# Altium schematic sheet CW308T_K24_Micro.SchDoc: <Enter Sheet Title>
size Letter; Organization: NewAE Technology Inc.; Address1: 1083 Queen St., Suite 196; Address2: Halifax; Address3: NS; Address4: Canada B3H 0B2; SheetApproved: NO
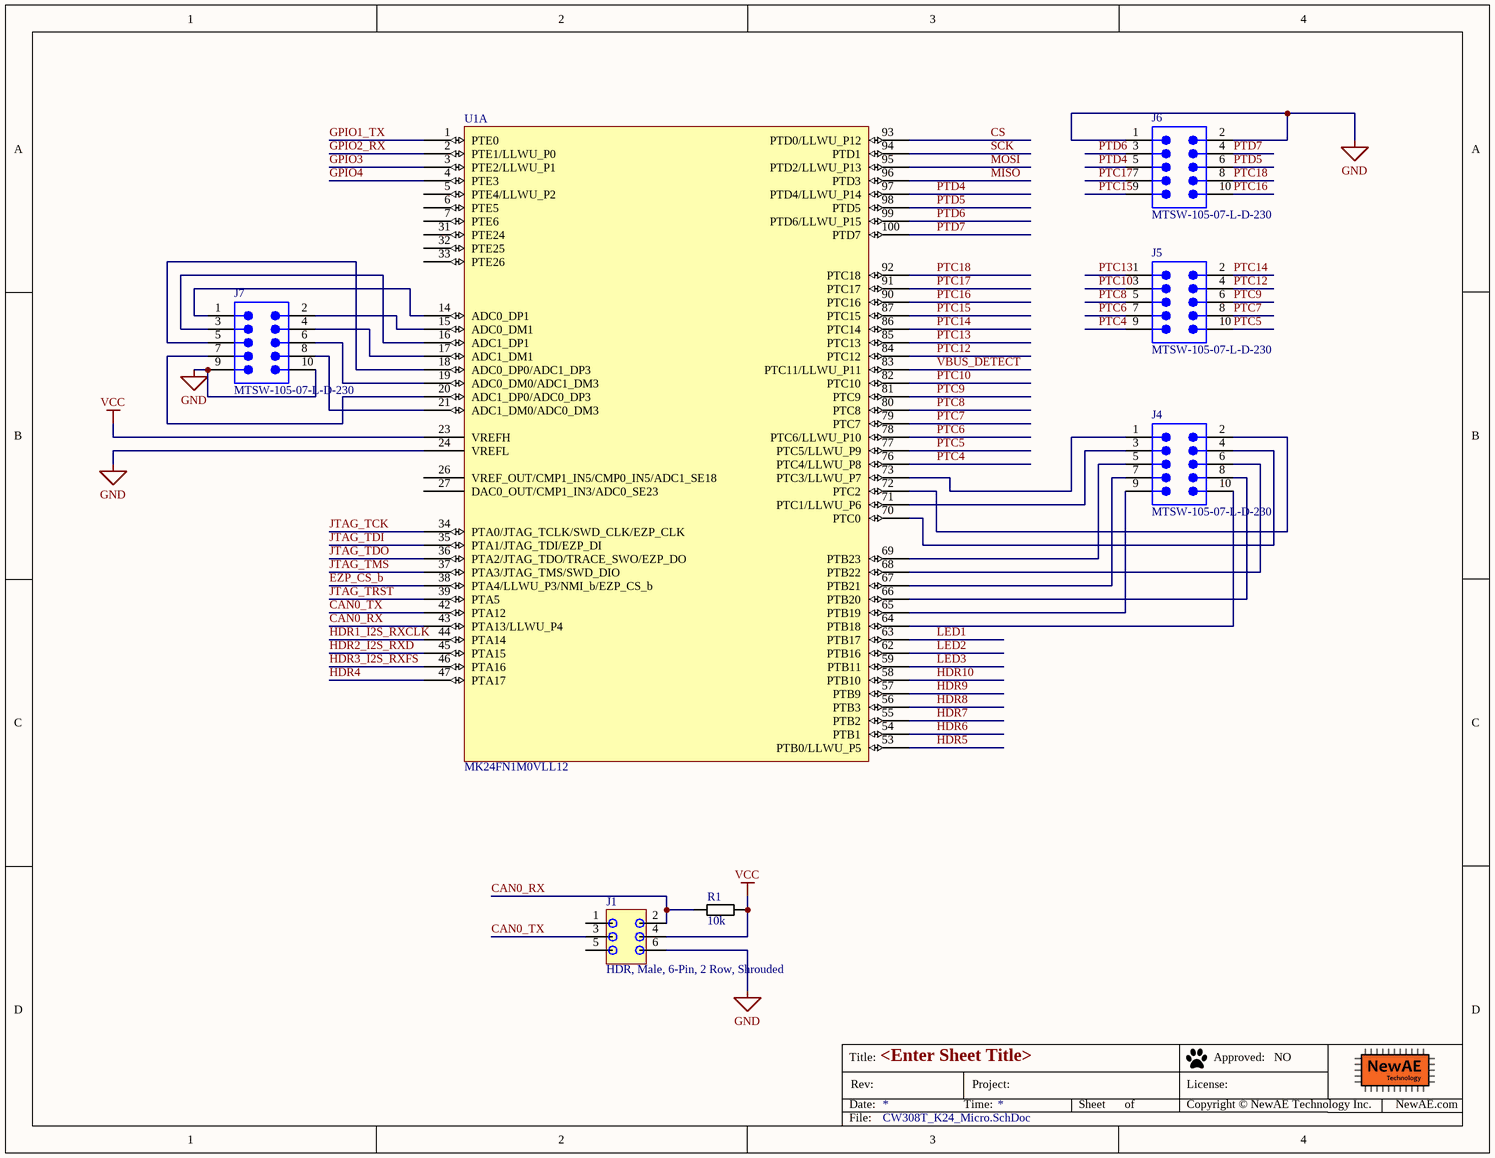
[diagram p0: CW308T_K24_Micro.SchDoc]

## Parts
J1  HDR, Male, 6-Pin, 2 Row, Shrouded  [HDR_6PIN_2ROW_SHROUD]
J4  MTSW-105-07-L-D-230  [SMTC-MTSW-105-07-X-D-230]
J5  MTSW-105-07-L-D-230  [SMTC-MTSW-105-07-X-D-230]
J6  MTSW-105-07-L-D-230  [SMTC-MTSW-105-07-X-D-230]
J7  MTSW-105-07-L-D-230  [SMTC-MTSW-105-07-X-D-230]
R1  10k  [RESC1608X55N]
U1  MK24FN1M0VLL12  [SQFP50P1600X1600X170-100N]  (part A of 2)

## Nets
GND: J1.6 J6.1 J6.2 J7.9 J7.10 U1.24(VREFL)
VCC: J1.4 R1.2 U1.23(VREFH)
CAN0_RX: J1.2 R1.1 U1.43(PTA13/LLWU_P4)
CAN0_TX: J1.3 U1.42(PTA12)
CS: U1.93(PTD0/LLWU_P12)
EZP_CS_b: U1.38(PTA4/LLWU_P3/NMI_b/EZP_CS_b)
GPIO1_TX: U1.1(PTE0)
GPIO2_RX: U1.2(PTE1/LLWU_P0)
GPIO3: U1.3(PTE2/LLWU_P1)
GPIO4: U1.4(PTE3)
HDR1_I2S_RXCLK: U1.44(PTA14)
HDR2_I2S_RXD: U1.45(PTA15)
HDR3_I2S_RXFS: U1.46(PTA16)
HDR4: U1.47(PTA17)
HDR5: U1.53(PTB0/LLWU_P5)
HDR6: U1.54(PTB1)
HDR7: U1.55(PTB2)
HDR8: U1.56(PTB3)
HDR9: U1.57(PTB9)
HDR10: U1.58(PTB10)
JTAG_TCK: U1.34(PTA0/JTAG_TCLK/SWD_CLK/EZP_CLK)
JTAG_TDI: U1.35(PTA1/JTAG_TDI/EZP_DI)
JTAG_TDO: U1.36(PTA2/JTAG_TDO/TRACE_SWO/EZP_DO)
JTAG_TMS: U1.37(PTA3/JTAG_TMS/SWD_DIO)
JTAG_TRST: U1.39(PTA5)
LED1: U1.63(PTB17)
LED2: U1.62(PTB16)
LED3: U1.59(PTB11)
MISO: U1.96(PTD3)
MOSI: U1.95(PTD2/LLWU_P13)
PTC4: J5.9 U1.76(PTC4/LLWU_P8)
PTC5: J5.10 U1.77(PTC5/LLWU_P9)
PTC6: J5.7 U1.78(PTC6/LLWU_P10)
PTC7: J5.8 U1.79(PTC7)
PTC8: J5.5 U1.80(PTC8)
PTC9: J5.6 U1.81(PTC9)
PTC10: J5.3 U1.82(PTC10)
PTC12: J5.4 U1.84(PTC12)
PTC13: J5.1 U1.85(PTC13)
PTC14: J5.2 U1.86(PTC14)
PTC15: J6.9 U1.87(PTC15)
PTC16: J6.10 U1.90(PTC16)
PTC17: J6.7 U1.91(PTC17)
PTC18: J6.8 U1.92(PTC18)
PTD4: J6.5 U1.97(PTD4/LLWU_P14)
PTD5: J6.6 U1.98(PTD5)
PTD6: J6.3 U1.99(PTD6/LLWU_P15)
PTD7: J6.4 U1.100(PTD7)
SCK: U1.94(PTD1)
VBUS_DETECT: U1.83(PTC11/LLWU_P11)
NetJ4_1: J4.1 U1.73(PTC3/LLWU_P7)
NetJ4_2: J4.2 U1.72(PTC2)
NetJ4_3: J4.3 U1.71(PTC1/LLWU_P6)
NetJ4_4: J4.4 U1.70(PTC0)
NetJ4_5: J4.5 U1.69(PTB23)
NetJ4_6: J4.6 U1.68(PTB22)
NetJ4_7: J4.7 U1.67(PTB21)
NetJ4_8: J4.8 U1.66(PTB20)
NetJ4_9: J4.9 U1.65(PTB19)
NetJ4_10: J4.10 U1.64(PTB18)
NetJ7_1: J7.1 U1.14(ADC0_DP1)
NetJ7_2: J7.2 U1.15(ADC0_DM1)
NetJ7_3: J7.3 U1.16(ADC1_DP1)
NetJ7_4: J7.4 U1.17(ADC1_DM1)
NetJ7_5: J7.5 U1.18(ADC0_DP0/ADC1_DP3)
NetJ7_6: J7.6 U1.19(ADC0_DM0/ADC1_DM3)
NetJ7_7: J7.7 U1.20(ADC1_DP0/ADC0_DP3)
NetJ7_8: J7.8 U1.21(ADC1_DM0/ADC0_DM3)

Not connected (* = marked no-connect by the designer): J1 1 5; U1 5(PTE4/LLWU_P2) 6(PTE5) 7(PTE6) 26(VREF_OUT/CMP1_IN5/CMP0_IN5/ADC1_SE18) 27(DAC0_OUT/CMP1_IN3/ADC0_SE23) 31(PTE24) 32(PTE25) 33(PTE26)

## Notes on the sheet
- Title:
- Date:
- Rev:
- Time:
- Project:
- Sheet
- of
- License:
- Copyright © NewAE Technology Inc.
- Approved:
- NewAE.com
- File:

## Library data of the parts
J1 = HDR_6PIN_2ROW_SHROUD: Manufacture 1: FCI Connectors; Manufacture Part Number 1: 75869-131LF; Component Group: Connector; Part Number: HDR_6PIN_2ROW_SHROUD; Pin Count: 6; Supplier 1: Digi-Key; Supplier Part Number 1: 609-2845-ND; Mounting Technology: Through-hole; RoHS: Yes; Component Kind: Standard; Component Type: Standard
J4-J7 = CMP-1024-00115-1: Manufacturer: Samtec; Pitch: 2.54 mm; PackageReference: MTSW-105-07-X-D-230; ComponentLink3Description: Package Specification; PartNumber: MTSW-105-07-L-D-230; DatasheetVersion: F-214; RoHS: True; Orientation: Vertical; Temperature Range: -55 to 125 degC; PackageVersion: BI, 2/1987; ComponentLink2Description: Datasheet; ComponentLink3URL: http://www.samtec.com/documents/webfiles/cpdf/MTSW-XXX-XX-X-X-XXXX-XX-XXX-MKT1.pdf; ComponentLink1Description: Manufacturer URL; ComponentLink2URL: http://www.samtec.com/documents/webfiles/pdf/MTSW.PDF; Mounting Technology: Through-hole; ComponentLink1URL: http://www.samtec.com
R1 = RCHIP-10K-0603: 10k res, 0603, 1%, 1/10W; Manufacture 1: Yageo; Manufacture Part Number 1: RC0603FR-0710KL; Component Group: Resistor; Case-EIA: 0603; Case-Metric: 1608; Rated Power: 0.1W; Rated Voltage: 75VDC; Part Number: RCHIP-10K-0603; Footprint: 0603; Pin Count: 2; Supplier 1: Digi-Key; Supplier Part Number 1: 311-10.0KHRCT-ND; Value: 10k; Tolerance: 1%; Mounting Technology: SMT; Temperature Range: -55C to 155C; Component Kind: Standard; Component Type: Standard
U1 = MK24FN1M0VLL12: Manufacture 1: NXP; Component Group: Digital IC; PP Material Stack: 0; Part Number: MK24FN1M0VLL12; Component Kind: Standard; Component Type: Standard; PP Rotation: 0; Footprint: TQFP100; Manufacture Part Number 1: MK24FN1M0VLL12; Pin Count: 100